# Altium schematic sheet MCU.SchDoc
size 420 x 297 mm; SheetNumber: 3; SheetTotal: 4
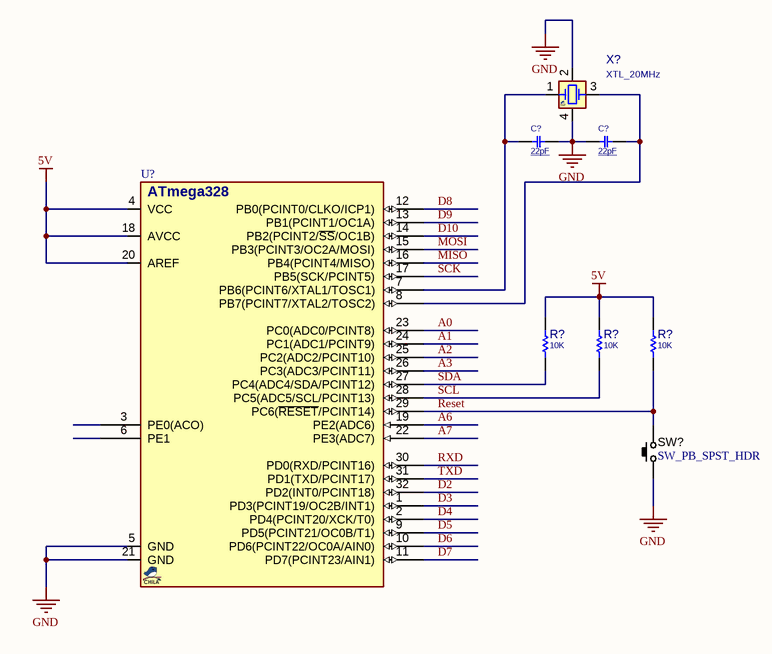
[diagram p0: MCU.SchDoc]

## Parts
(Parts that share a designator on the sheet are numbered #1, #2 ... from top to bottom, then left to right.)
C?#1  22pF  [C0402]
C?#2  22pF  [C0402]
R?#1  10K  [R0402]
R?#2  10K  [R0402]
R?#3  10K  [R0402]
SW?  SW_PB_SPST_HDR  [HDR_M_1X3]  (mechanical)
U?  ATMEGA328  [QFG80_32]  (value not drawn)
X?  XTL_20MHz  [XTL_4_3225]

## Nets
5V: R?#1.2 R?#2.2 R?#3.2 U?.4(VCC) U?.18(AVCC) U?.20(AREF)
GND: C?#1.2 C?#2.1 SW?.1 U?.5(GND) U?.21(GND) X?.2(GND2) X?.4(GND4)
A0: U?.23(PC0(ADC0/PCINT8))
A1: U?.24(PC1(ADC1/PCINT9))
A2: U?.25(PC2(ADC2/PCINT10))
A3: U?.26(PC3(ADC3/PCINT11))
A6: U?.19(PE2(ADC6))
A7: U?.22(PE3(ADC7))
D2: U?.32(PD2(INT0/PCINT18))
D3: U?.1(PD3(PCINT19/OC2B/INT1))
D4: U?.2(PD4(PCINT20/XCK/T0))
D5: U?.9(PD5(PCINT21/OC0B/T1))
D6: U?.10(PD6(PCINT22/OC0A/AIN0))
D7: U?.11(PD7(PCINT23/AIN1))
D8: U?.12(PB0(PCINT0/CLKO/ICP1))
D9: U?.13(PB1(PCINT1/OC1A))
D10: U?.14(PB2(PCINT2/~{SS}/OC1B))
MISO: U?.16(PB4(PCINT4/MISO))
MOSI: U?.15(PB3(PCINT3/OC2A/MOSI))
Reset: R?#3.1 SW?.2 U?.29(PC6(~{RESET}/PCINT14))
RXD: U?.30(PD0(RXD/PCINT16))
SCK: U?.17(PB5(SCK/PCINT5))
SCL: R?#2.1 U?.28(PC5(ADC5/SCL/PCINT13))
SDA: R?#1.1 U?.27(PC4(ADC4/SDA/PCINT12))
TXD: U?.31(PD1(TXD/PCINT17))
NetC?#1_1: C?#1.1 U?.7(PB6(PCINT6/XTAL1/TOSC1)) X?.1
NetC?#2_2: C?#2.2 U?.8(PB7(PCINT7/XTAL2/TOSC2)) X?.3

Not connected (* = marked no-connect by the designer): U? 3(PE0(ACO)) 6(PE1)

## Notes on the sheet
- THIS DOCUMENT AND THE DATA DISCLOSED HEREIN OR
- HEREWITH IS THE PROPERTY OF ALTIUM LIMITED AND MAY
- DWG NO:
- REVISION
- REV:
- DESCRIPTION
- DATE
- APPROVED
- BE FREELY DISTRIBUTED IN WHOLE. NO RIGHTS ARE
- RESERVED OR EXPRESS OR IMPLIED WARANTEE GIVEN.
- ENG:
- APPROVALS
- PROJECT
- DSN:
- CHK:
- REFERENCE DOCUMENTS
- PROJECT REVISION:
- TITLE
- DOCUMENT REVISION:
- DESIGN ITEM:
- BOM:
- FAB DWG:
- PCB DWG:
- ASSY DWG:
- SCALE:
- A3
- SIZE
- CAGE CODE
- FILE NAME
- DWG NO.
- SHEET
- OF
- REV
- (in symbol ATMEGA328PB_QFN32) ATmega328

## Library data of the parts
C?#1 C?#2 = CAP_SMD_MLCC: CAP, MLCC, 1nF, 50V, C0G, 10%, 0402; MANF_P#: MANF_PART#; MANF: Murata; PARAM: C0G, 10%; PRICE: 100= 1$; DESC: CAP, MLCC, 1nF, 50V, C0G, 10%, 0402; PARAM2: 50V; ASSEMBLY: ASSEMBLY; VALUE: 22pF
R?#1-R?#3 = RES_SMD: RESISTOR, SMD; PARAM: -W; DESC: DESCRIPTION; DIST#: MOUSER; PARAM2: 1%; MANF_P#: -; MANF: -; ASSEMBLY: ASSEMBLY; PRICE: 100= 0.5$; VALUE: 10K
SW? = SWPBT_SPST_HDR: Switch momentary SPST panel mount with wire leads; MANF: C&K Components; MANF_P#: AP4E200SWBE; VALUE: SW_PB_SPST_HDR
U? = ATMEGA328PB_QFN32: MCU, AVR, 8-Bit, 16KB, 1KB RAM, 20MHz; PART#ALT: ATmega8-48-88-168-328; MANF_P#: ATMEGA328PB-MN; DESC: 1KB EEPROM; MANF: ATMEL/MICROCHIP; PARAM2: 1.8~5.5V; PARAM: 32KB, 2KB RAM, 20MHz, -40~85°C; PRICE: 1.4$; VALUE: ATMEGA328
X? = XTL_4_25MHZ_3225A: CRYSTAL 25.00 MHZ 18pF, 50PPM; MANF: ABRACON; DESC: DESCRIPTION; DIST#: MOUSER; MANF_P#: ABM8-25.000MHZ-B2-T; PARAM2: 0.5$; ASSEMBLY: ASSEMBLY; PARAM: 50PPM; PRICE: PRICE; VALUE: XTL_20MHz